# EAGLE schematic main_schematic (EAGLE 9.0.1)
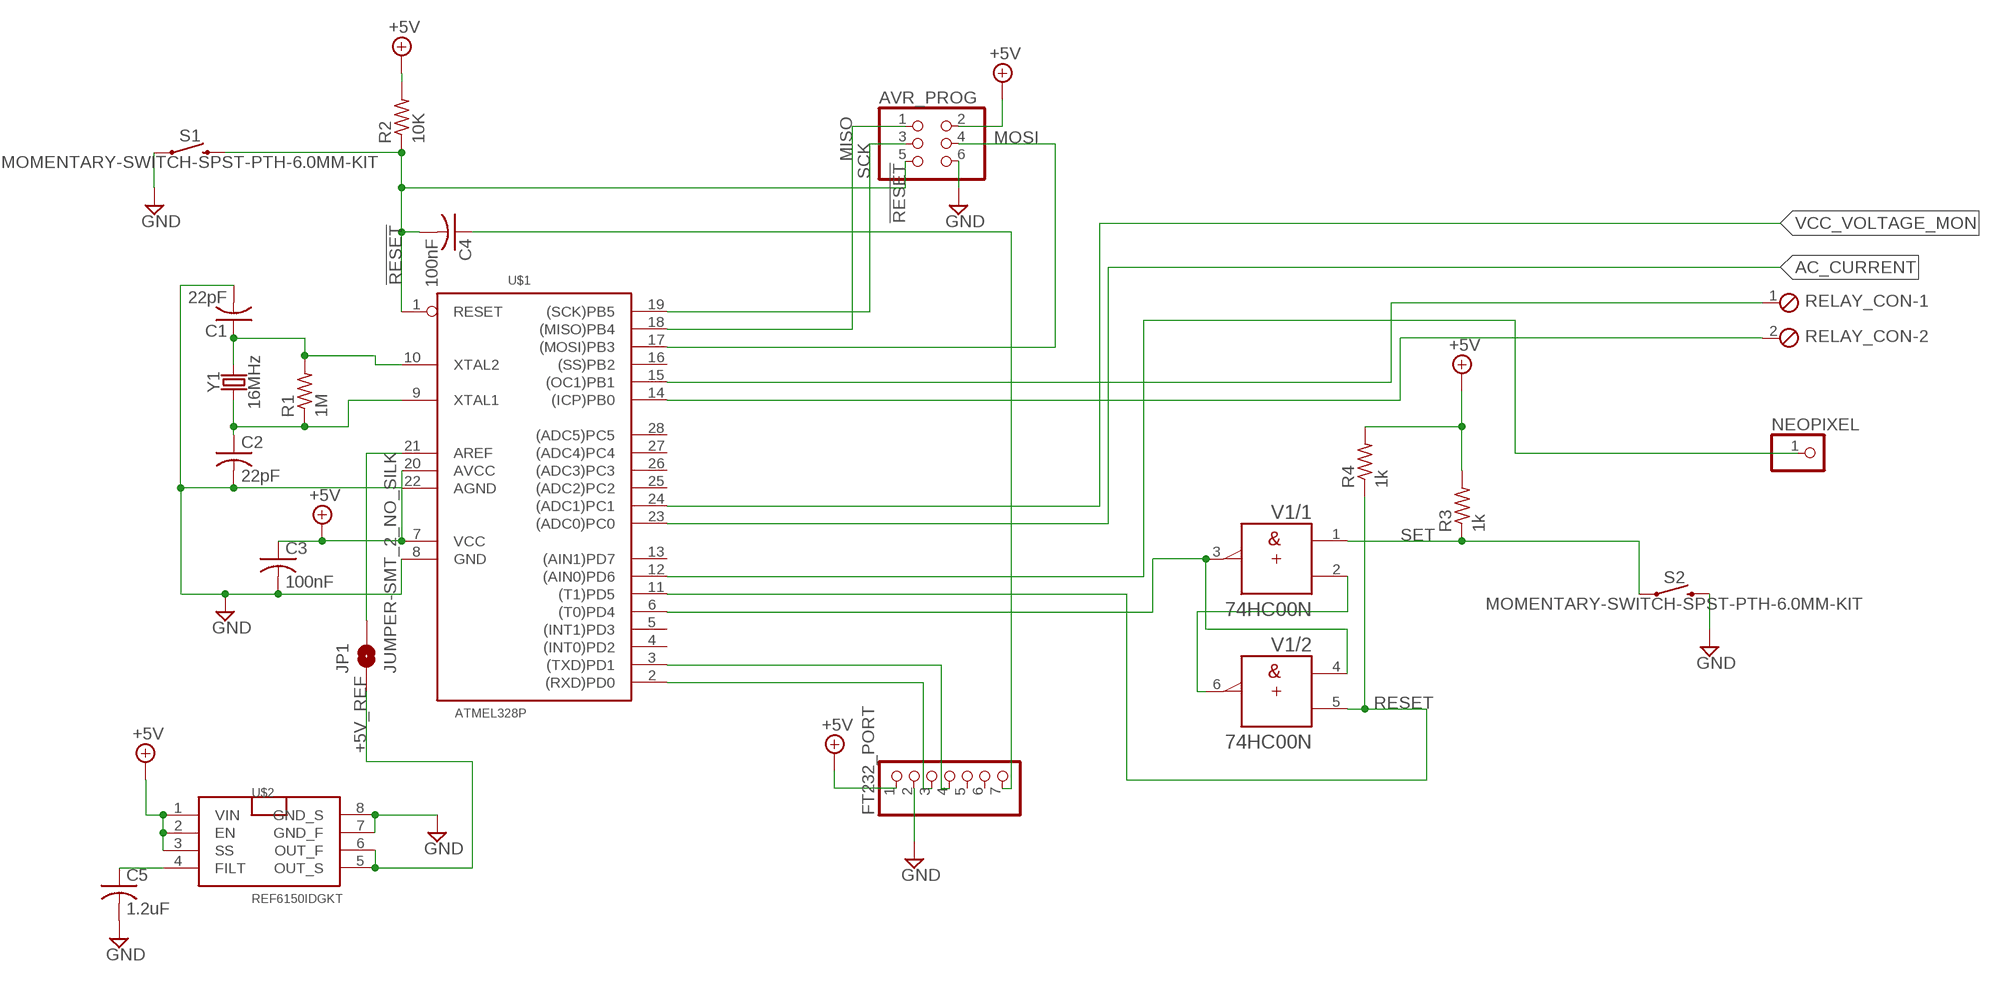
[diagram p0: schematic, sheet 1]

## Parts
AVR_PROG  PINHD-2X3  [2X03]
C1  22pF  C-USC1206  [C1206]
C2  22pF  C-USC1206  [C1206]
C3  100nF  C-USC1206  [C1206]
C4  100nF  C-USC1206  [C1206]
C5  1.2uF  C-USC1206  [C1206]
FT232_PORT  PINHD-1X7  [1X07]
JP1  JUMPER-SMT_2_NO_SILK  [SMT-JUMPER_2_NO_SILK]
NEOPIXEL  PINHD-1X1  [1X01]
R1  1M  R-US_0309/10  [0309/10]
R2  10K  R-US_0309/10  [0309/10]
R3  1k  R-US_0309/10  [0309/10]
R4  1k  R-US_0309/10  [0309/10]
RELAY_CON  MPT2  [2POL254]
S1  MOMENTARY-SWITCH-SPST-PTH-6.0MM-KIT  [TACTILE_SWITCH_PTH_6.0MM_KIT]
S2  MOMENTARY-SWITCH-SPST-PTH-6.0MM-KIT  [TACTILE_SWITCH_PTH_6.0MM_KIT]
U$1  ATMEL328P  [DIL28-3]
U$2  REF6150IDGKT  [TSSOP8]
V1  74HC00N  [DIL14]
Y1  16MHz  CRYSTAL-16MHZPTH-HC49US  [HC49US]

## Nets
!RESET: AVR_PROG.5 C4.2 R2.1 S1.3 U$1.1(RESET)
+5V: AVR_PROG.2 C3.1 FT232_PORT.1 R2.2 R3.2 R4.2 U$1.7(VCC) U$1.20(AVCC) U$2.1(VIN) U$2.2(EN) U$2.3(SS)
+5V_REF: JP1.1 U$2.5(OUT_S) U$2.6(OUT_F)
AC_CURRENT: U$1.23((ADC0)PC0)
GND: AVR_PROG.6 C1.2 C2.2 C3.2 C5.2 FT232_PORT.2 S1.1 S2.3 U$1.8(GND) U$1.22(AGND) U$2.7(GND_F) U$2.8(GND_S)
MISO: AVR_PROG.1 U$1.18((MISO)PB4)
MOSI: AVR_PROG.4 U$1.17((MOSI)PB3)
N$1: C2.1 R1.1 U$1.9(XTAL1) Y1.1
N$2: C1.1 R1.2 U$1.10(XTAL2) Y1.2
N$3: C5.1 U$2.4(FILT)
N$4: U$1.6((T0)PD4) V1.3(/1:Y) V1.4(/2:A)
N$5: V1.2(/1:B) V1.6(/2:Y)
N$6: FT232_PORT.3 U$1.2((RXD)PD0)
N$7: FT232_PORT.4 U$1.3((TXD)PD1)
N$8: C4.1 FT232_PORT.7
N$9: NEOPIXEL.1 U$1.12((AIN0)PD6)
N$10: RELAY_CON.2 U$1.14((ICP)PB0)
N$11: JP1.2 U$1.21(AREF)
N$12: RELAY_CON.1 U$1.15((OC1)PB1)
RESET: R4.1 U$1.11((T1)PD5) V1.5(/2:B)
SCK: AVR_PROG.3 U$1.19((SCK)PB5)
SET: R3.1 S2.1 V1.1(/1:A)
VCC_VOLTAGE_MON: U$1.24((ADC1)PC1)
Unconnected: FT232_PORT.5 FT232_PORT.6 U$1.4((INT0)PD2) U$1.5((INT1)PD3) U$1.13((AIN1)PD7) U$1.16((SS)PB2) U$1.25((ADC2)PC2) U$1.26((ADC3)PC3) U$1.27((ADC4)PC4) U$1.28((ADC5)PC5) V1.8(/3:Y) V1.9(/3:A) V1.10(/3:B) V1.11(/4:Y) V1.12(/4:A) V1.13(/4:B)

## Power pins joined to a net without a drawn wire
+UB: V1.14(/+UB:+UB)
-UB: V1.7(/-UB:-UB)

## Library data of the parts
AVR_PROG = pinhead:PINHD-2X3: PIN HEADER
C1-C5 = resistor:C-US: CAPACITOR, American symbol
FT232_PORT = pinhead:PINHD-1X7: PIN HEADER
JP1 = SparkFun-Jumpers:JUMPER-SMT_2_NO: Normally open jumper This jumper has two pads in close proximity to each other. Apply solder to close the connection. Round pads are easier to solder for beginners, but are a lot larger. SparkFun Product that uses the round pads: SparkFun EL Sequencer <https://www.sparkfun.com/products/12781>
NEOPIXEL = pinhead:PINHD-1X1: PIN HEADER
R1-R4 = resistor:R-US_: RESISTOR, American symbol
RELAY_CON = con-phoenix-254:MPT2: PHOENIX CONNECTOR; OC_FARNELL: unknown; OC_NEWARK: unknown
S1 S2 = SparkFun-Switches:MOMENTARY-SWITCH-SPST: Momentary Switch (Pushbutton) - SPST Normally-open (NO) SPST momentary switches (buttons, pushbuttons). Variants PTH-12MM - 12mm square, through-hole Momentary Pushbutton Switch - 12mm Square <https://www.sparkfun.com/products/9190> (COM-09190) PTH-6.0MM, PTH-6.0MM-KIT - 6.0mm square, through-hole Mini Pushbutton Switch <https://www.sparkfun.com/products/97> (COM-00097) KIT package intended for soldering kit's - only one side of pads' copper is exposed. PTH-RIGHT-ANGLE-KIT - Right-angle, through-hole Right Angle Tactile Button <https://www.sparkfun.com/products/10791> - Used on SparkFun BigTime Watch Kit <https://www.sparkfun.com/products/11734> SMD-12MM - 12mm square, surface-mount Tactile Button - SMD (12mm) <https://www.sparkfun.com/products/12993> (COM-12993) Used on SparkFun PicoBoard <https://www.sparkfun.com/products/11888> SMD-4.5MM - 4.5mm Square Trackball Switch Used on SparkFun Blackberry Trackballer Breakout <https://www.sparkfun.com/products/13169> SMD-4.6MMX2.8MM - 4.60mm x 2.80mm, surface mount Used on SparkFun SAMD21 Mini Breakout <https://www.sparkfun.com/products/13664> SMD-5.2MM, SMD-5.2-REDUNDANT - 5.2mm square, surface-mount Mini Pushbutton Switch - SMD <https://www.sparkfun.com/products/8720> (COM-08720) Used on Arduino Pro Mini <https://www.sparkfun.com/products/11114> REDUNDANT package connects both switch circuits together SMD-6.0X3.5MM - 6.0 x 3.5mm, surface mount Momentary Reset Switch SMD <https://www.sparkfun.com/products/8229> (COM-08229) SMD-6.2MM-TALL - 6.2mm square, surface mount Tactile Button - SMD (6mm) <https://www.sparkfun.com/products/12992> Used on SparkFun Digital Sandbox <https://www.sparkfun.com/products/12651> SMD-RIGHT-ANGLE - Right-angle, surface mount Used on SparkFun Block for Intel® Edison - Arduino <https://www.sparkfun.com/products/13036>; PROD_ID: SWCH-08441; SF_SKU: COM-00097
U$1 = nates:ATMEL328P
U$2 = nates:REF6150IDGKT
V1 = 74ttl-din:74*00: Quad 2-input NAND gate
Y1 = SparkFun-Clocks:CRYSTAL-16MHZ: 16MHz Crystal Digikey Example <http://www.digikey.com/product-search/en?keywords=535-9122-1-ND> Frequency: 16MHz Frequency Stability: ±50ppm Frequency Tolerance: ±20ppm Load Capacitance: 18pF SparkFun Products: Pro Micro -5V/16MHz <https://www.sparkfun.com/products/12640> SparkFun Serial Enabled LCD Kit <https://www.sparkfun.com/products/10097>; PROD_ID: XTAL-08181; SF_ID: COM-00536